# EAGLE schematic shield_SIP800L (EAGLE 7.5.0)
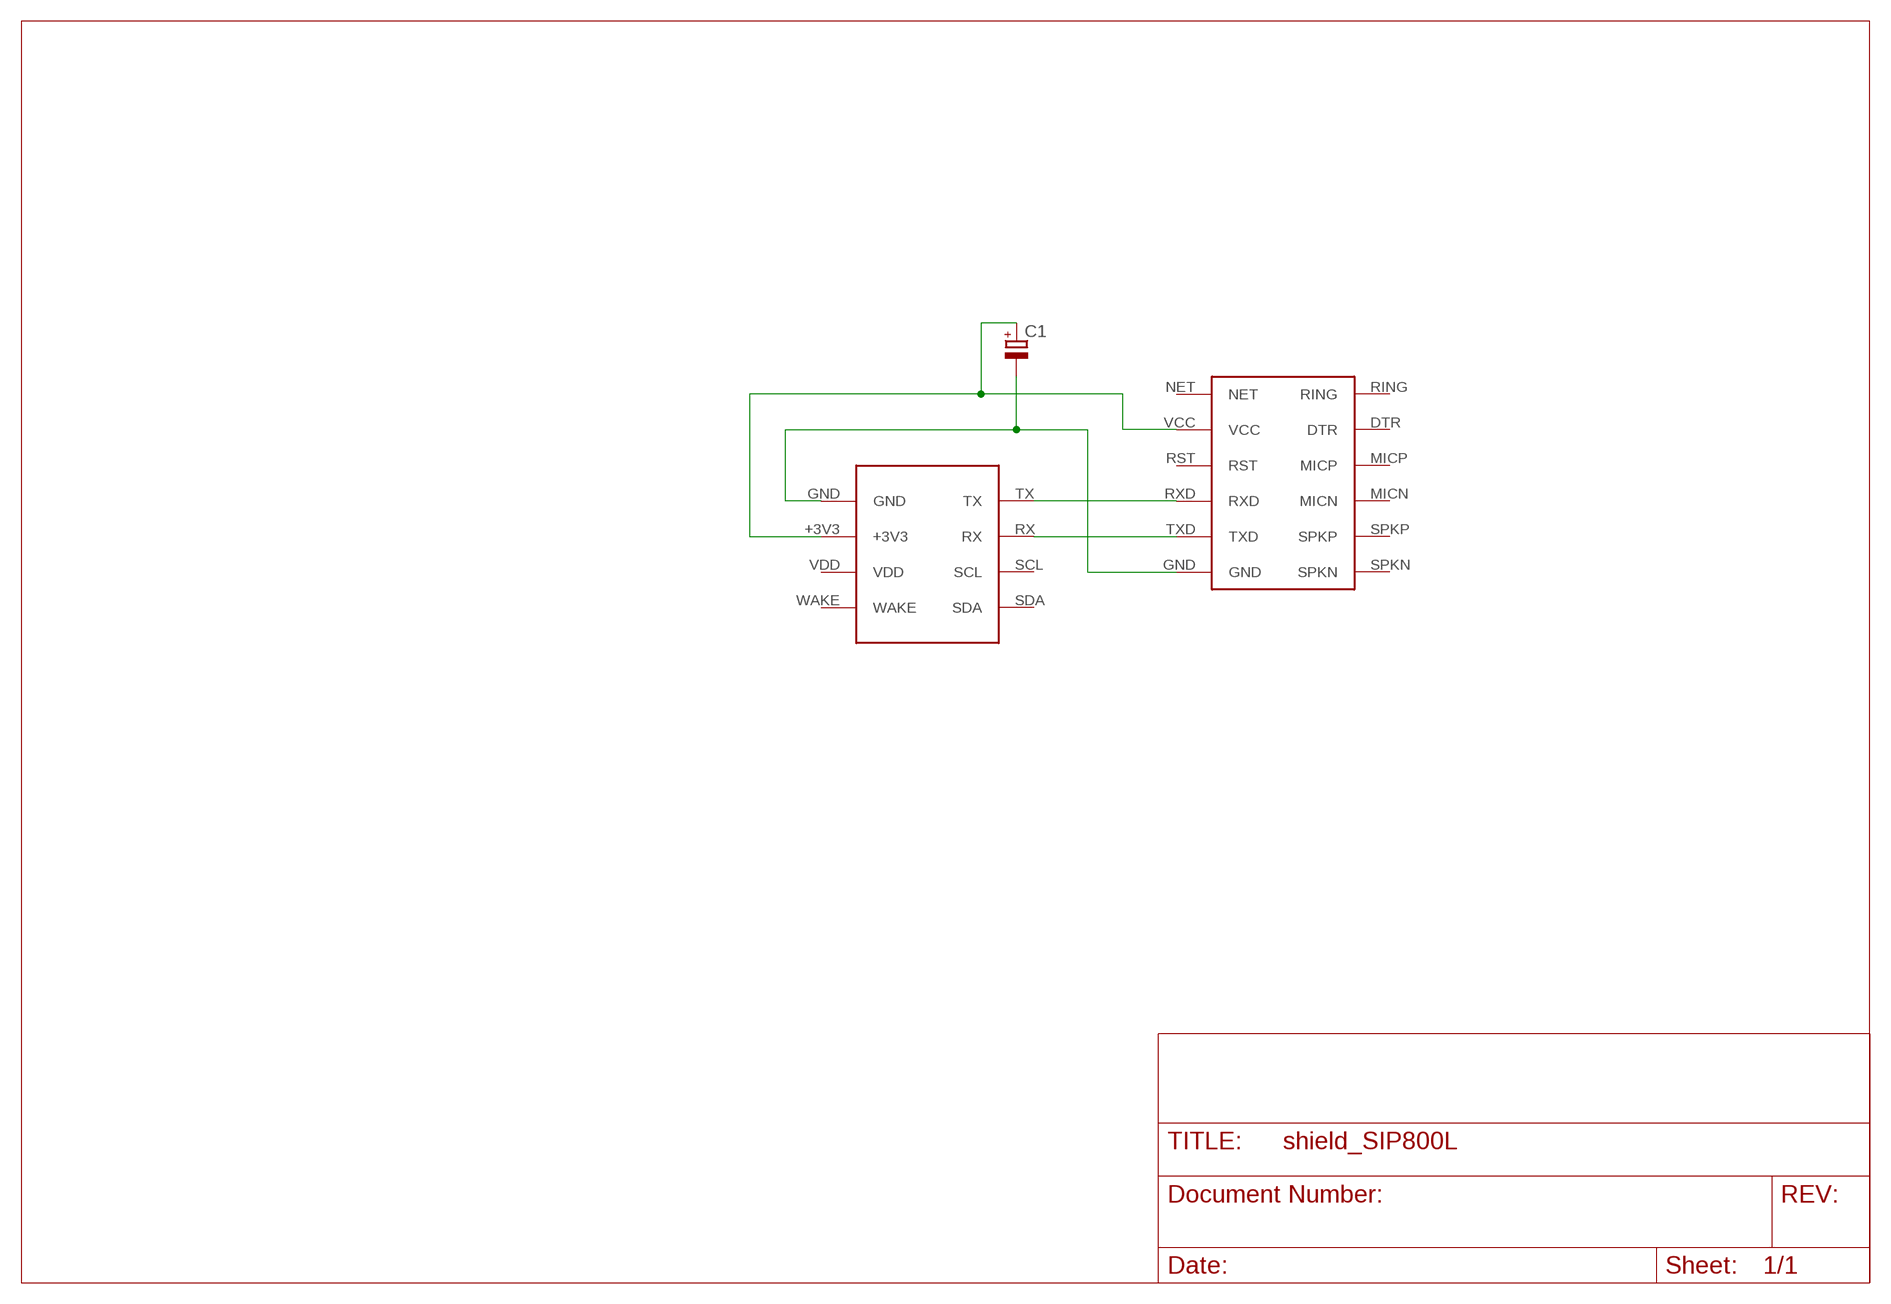
[diagram p0: schematic, sheet 1]

## Parts
C1  CPOL-EUE5-13  [E5-13]
U$1  SHIELD  [SHIELD]
U$6  SIM800L  [SIM800L]

## Nets
N$1: U$1.RX U$6.TXD
N$2: U$1.TX U$6.RXD
N$3: C1.- U$1.GND U$6.GND
N$4: C1.+ U$1.+3V3 U$6.VCC
Unconnected: U$1.SCL U$1.SDA U$1.WAKE U$6.DTR U$6.MICN U$6.MICP U$6.NET U$6.RING U$6.RST U$6.SPKN U$6.SPKP

## Power pins joined to a net without a drawn wire
VDD: U$1.VDD

## Library data of the parts
C1 = rcl:CPOL-EU: POLARIZED CAPACITOR, European symbol
U$1 = balance:SHIELD
U$6 = balance:SIM800L

## Net classes
0 default: clearance 0.205 mm